# Altium schematic sheet Control.SchDoc
size A4; SheetNumber: 1; SheetTotal: 4
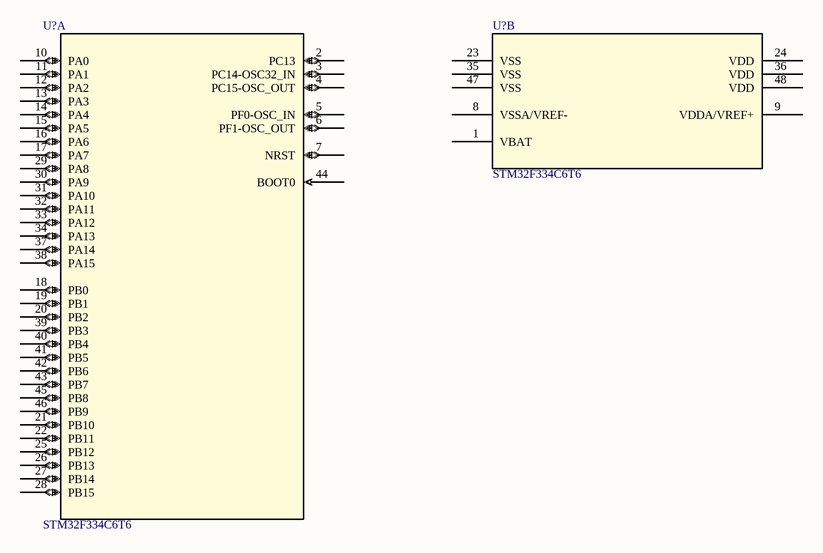
[diagram p0: Control.SchDoc]

## Parts
(Parts that share a designator on the sheet are numbered #1, #2 ... from top to bottom, then left to right.)
U?#1  STM32F334C6T6  [LQFP48-7x7mm]  (part A of 2)
U?#2  STM32F334C6T6  [LQFP48-7x7mm]  (part B of 2)

## Nets

Not connected (* = marked no-connect by the designer): U?#1 2(PC13) 3(PC14-OSC32_IN) 4(PC15-OSC_OUT) 5(PF0-OSC_IN) 6(PF1-OSC_OUT) 7(NRST) 10(PA0) 11(PA1) 12(PA2) 13(PA3) 14(PA4) 15(PA5) 16(PA6) 17(PA7) 18(PB0) 19(PB1) 20(PB2) 21(PB10) 22(PB11) 25(PB12) 26(PB13) 27(PB14) 28(PB15) 29(PA8) 30(PA9) 31(PA10) 32(PA11) 33(PA12) 34(PA13) 37(PA14) 38(PA15) 39(PB3) 40(PB4) 41(PB5) 42(PB6) 43(PB7) 44(BOOT0) 45(PB8) 46(PB9); U?#2 1(VBAT) 8(VSSA/VREF-) 9(VDDA/VREF+) 23(VSS) 24(VDD) 35(VSS) 36(VDD) 47(VSS) 48(VDD)

## Library data of the parts
U?#1 U?#2 = STM32F334C6T6: No Description Available; Mfr_Name: STMicroelectronics; Copyright: Copyright (C) 2021 Ultra Librarian. All rights reserved.; Manufacturer_Part_Number: STM32F334C6T6; RefDes: RefDes; Type: DEV